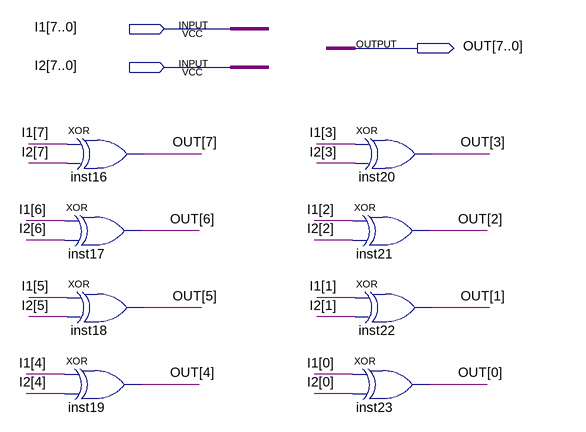
[diagram p0: schematic sheet]
// Quartus schematic XOR8.bdf as structural Verilog: 8 symbols, 3 pins
module XOR8 (
  input  [7:0] I1,
  input  [7:0] I2,
  output [7:0] OUT
);

  xor inst16 (OUT[7], I1[7], I2[7]);
  xor inst17 (OUT[6], I1[6], I2[6]);
  xor inst18 (OUT[5], I1[5], I2[5]);
  xor inst19 (OUT[4], I1[4], I2[4]);
  xor inst20 (OUT[3], I1[3], I2[3]);
  xor inst21 (OUT[2], I1[2], I2[2]);
  xor inst22 (OUT[1], I1[1], I2[1]);
  xor inst23 (OUT[0], I1[0], I2[0]);
endmodule
